# EAGLE schematic BigBus (EAGLE 7.7.0)
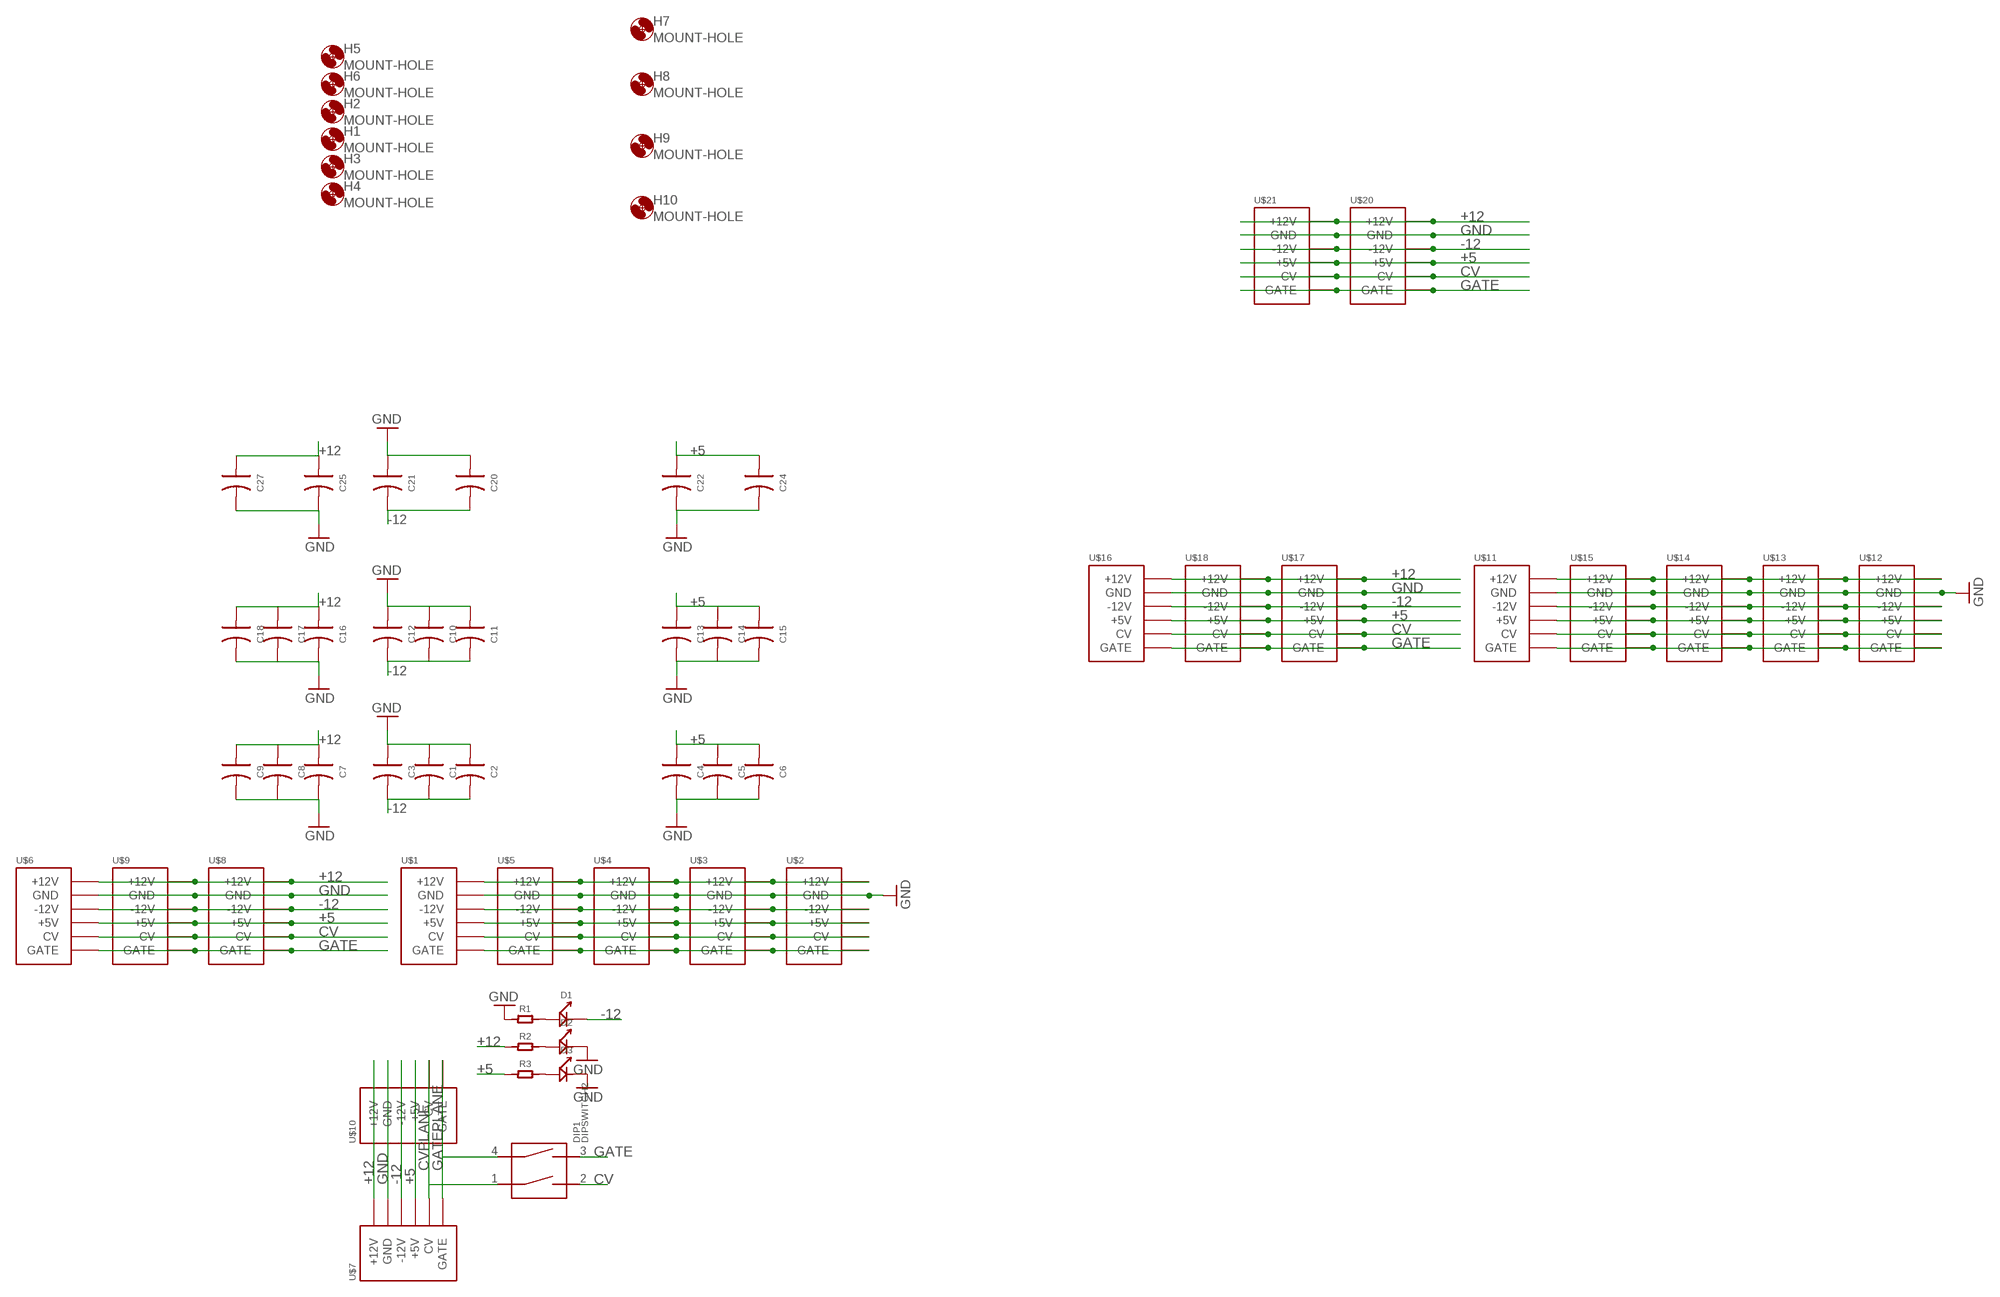
[diagram p0: schematic, sheet 1]

## Parts
C1  C-POLAR-A  [AVX-A]
C2  C-POLAR-A  [AVX-A]
C3  C-POLAR-A  [AVX-A]
C4  C-POLAR-A  [AVX-A]
C5  C-POLAR-A  [AVX-A]
C6  C-POLAR-A  [AVX-A]
C7  C-POLAR-A  [AVX-A]
C8  C-POLAR-A  [AVX-A]
C9  C-POLAR-A  [AVX-A]
C10  C-POLAR-A  [AVX-A]
C11  C-POLAR-A  [AVX-A]
C12  C-POLAR-A  [AVX-A]
C13  C-POLAR-A  [AVX-A]
C14  C-POLAR-A  [AVX-A]
C15  C-POLAR-A  [AVX-A]
C16  C-POLAR-A  [AVX-A]
C17  C-POLAR-A  [AVX-A]
C18  C-POLAR-A  [AVX-A]
C20  C-POLAR-A  [AVX-A]
C21  C-POLAR-A  [AVX-A]
C22  C-POLAR-A  [AVX-A]
C24  C-POLAR-A  [AVX-A]
C25  C-POLAR-A  [AVX-A]
C27  C-POLAR-A  [AVX-A]
D1  LED  [LED0603]
D2  LED  [LED0603]
D3  LED  [LED0603]
DIP1  DIPSWITCH2  [DIPSWITCH2]
H1  MOUNT-HOLE  [3.2-NOMARKINGS-SMALLSAFEZONE]
H2  MOUNT-HOLE  [3.2-NOMARKINGS-SMALLSAFEZONE]
H3  MOUNT-HOLE  [3.2-NOMARKINGS-SMALLSAFEZONE]
H4  MOUNT-HOLE  [3.2-NOMARKINGS-SMALLSAFEZONE]
H5  MOUNT-HOLE  [3.2-NOMARKINGS-SMALLSAFEZONE]
H6  MOUNT-HOLE  [3.2-NOMARKINGS-SMALLSAFEZONE]
H7  MOUNT-HOLE  [3.2-NOMARKINGS-SMALLSAFEZONE]
H8  MOUNT-HOLE  [3.2-NOMARKINGS-SMALLSAFEZONE]
H9  MOUNT-HOLE  [3.2-NOMARKINGS-SMALLSAFEZONE]
H10  MOUNT-HOLE  [3.2-NOMARKINGS-SMALLSAFEZONE]
R1  R-0603  [R0603]
R2  R-0603  [R0603]
R3  R-0603  [R0603]
U$1  POWER  [POWER_16]
U$2  POWER  [POWER_16]
U$3  POWER  [POWER_16]
U$4  POWER  [POWER_16]
U$5  POWER  [POWER_16]
U$6  POWER  [POWER_16]
U$7  POWER  [POWER_16]
U$8  POWER  [POWER_16]
U$9  POWER  [POWER_16]
U$10  POWER  [POWER_16]
U$11  POWER  [POWER_16]
U$12  POWER  [POWER_16]
U$13  POWER  [POWER_16]
U$14  POWER  [POWER_16]
U$15  POWER  [POWER_16]
U$16  POWER  [POWER_16]
U$17  POWER  [POWER_16]
U$18  POWER  [POWER_16]
U$20  POWER  [POWER_16]
U$21  POWER  [POWER_16]

## Nets
+5: C4.+ C5.+ C6.+ C13.+ C14.+ C15.+ C22.+ C24.+ R3.1 U$1.11(+5V) U$1.12(+5V) U$2.11(+5V) U$2.12(+5V) U$3.11(+5V) U$3.12(+5V) U$4.11(+5V) U$4.12(+5V) U$5.11(+5V) U$5.12(+5V) U$6.11(+5V) U$6.12(+5V) U$7.11(+5V) U$7.12(+5V) U$8.11(+5V) U$8.12(+5V) U$9.11(+5V) U$9.12(+5V) U$10.11(+5V) U$10.12(+5V) U$11.11(+5V) U$11.12(+5V) U$12.11(+5V) U$12.12(+5V) U$13.11(+5V) U$13.12(+5V) U$14.11(+5V) U$14.12(+5V) U$15.11(+5V) U$15.12(+5V) U$16.11(+5V) U$16.12(+5V) U$17.11(+5V) U$17.12(+5V) U$18.11(+5V) U$18.12(+5V) U$20.11(+5V) U$20.12(+5V) U$21.11(+5V) U$21.12(+5V)
+12: C7.+ C8.+ C9.+ C16.+ C17.+ C18.+ C25.+ C27.+ R2.1 U$1.9(+12V) U$1.10(+12V) U$2.9(+12V) U$2.10(+12V) U$3.9(+12V) U$3.10(+12V) U$4.9(+12V) U$4.10(+12V) U$5.9(+12V) U$5.10(+12V) U$6.9(+12V) U$6.10(+12V) U$7.9(+12V) U$7.10(+12V) U$8.9(+12V) U$8.10(+12V) U$9.9(+12V) U$9.10(+12V) U$10.9(+12V) U$10.10(+12V) U$11.9(+12V) U$11.10(+12V) U$12.9(+12V) U$12.10(+12V) U$13.9(+12V) U$13.10(+12V) U$14.9(+12V) U$14.10(+12V) U$15.9(+12V) U$15.10(+12V) U$16.9(+12V) U$16.10(+12V) U$17.9(+12V) U$17.10(+12V) U$18.9(+12V) U$18.10(+12V) U$20.9(+12V) U$20.10(+12V) U$21.9(+12V) U$21.10(+12V)
-12: C1.- C2.- C3.- C10.- C11.- C12.- C20.- C21.- D1.- U$1.1(-12V) U$1.2(-12V) U$2.1(-12V) U$2.2(-12V) U$3.1(-12V) U$3.2(-12V) U$4.1(-12V) U$4.2(-12V) U$5.1(-12V) U$5.2(-12V) U$6.1(-12V) U$6.2(-12V) U$7.1(-12V) U$7.2(-12V) U$8.1(-12V) U$8.2(-12V) U$9.1(-12V) U$9.2(-12V) U$10.1(-12V) U$10.2(-12V) U$11.1(-12V) U$11.2(-12V) U$12.1(-12V) U$12.2(-12V) U$13.1(-12V) U$13.2(-12V) U$14.1(-12V) U$14.2(-12V) U$15.1(-12V) U$15.2(-12V) U$16.1(-12V) U$16.2(-12V) U$17.1(-12V) U$17.2(-12V) U$18.1(-12V) U$18.2(-12V) U$20.1(-12V) U$20.2(-12V) U$21.1(-12V) U$21.2(-12V)
CV: DIP1.2 U$1.13(CV) U$1.14(CV) U$2.13(CV) U$2.14(CV) U$3.13(CV) U$3.14(CV) U$4.13(CV) U$4.14(CV) U$5.13(CV) U$5.14(CV) U$6.13(CV) U$6.14(CV) U$8.13(CV) U$8.14(CV) U$9.13(CV) U$9.14(CV) U$11.13(CV) U$11.14(CV) U$12.13(CV) U$12.14(CV) U$13.13(CV) U$13.14(CV) U$14.13(CV) U$14.14(CV) U$15.13(CV) U$15.14(CV) U$16.13(CV) U$16.14(CV) U$17.13(CV) U$17.14(CV) U$18.13(CV) U$18.14(CV) U$20.13(CV) U$20.14(CV) U$21.13(CV) U$21.14(CV)
CVPLANE: DIP1.1 U$7.13(CV) U$7.14(CV) U$10.13(CV) U$10.14(CV)
GATE: DIP1.3 U$1.15(GATE) U$1.16(GATE) U$2.15(GATE) U$2.16(GATE) U$3.15(GATE) U$3.16(GATE) U$4.15(GATE) U$4.16(GATE) U$5.15(GATE) U$5.16(GATE) U$6.15(GATE) U$6.16(GATE) U$8.15(GATE) U$8.16(GATE) U$9.15(GATE) U$9.16(GATE) U$11.15(GATE) U$11.16(GATE) U$12.15(GATE) U$12.16(GATE) U$13.15(GATE) U$13.16(GATE) U$14.15(GATE) U$14.16(GATE) U$15.15(GATE) U$15.16(GATE) U$16.15(GATE) U$16.16(GATE) U$17.15(GATE) U$17.16(GATE) U$18.15(GATE) U$18.16(GATE) U$20.15(GATE) U$20.16(GATE) U$21.15(GATE) U$21.16(GATE)
GATEPLANE: DIP1.4 U$7.15(GATE) U$7.16(GATE) U$10.15(GATE) U$10.16(GATE)
GND: C1.+ C2.+ C3.+ C4.- C5.- C6.- C7.- C8.- C9.- C10.+ C11.+ C12.+ C13.- C14.- C15.- C16.- C17.- C18.- C20.+ C21.+ C22.- C24.- C25.- C27.- D2.- D3.- R1.1 U$1.3(GND) U$1.4(GND) U$1.5(GND) U$1.6(GND) U$1.7(GND) U$1.8(GND) U$2.3(GND) U$2.4(GND) U$2.5(GND) U$2.6(GND) U$2.7(GND) U$2.8(GND) U$3.3(GND) U$3.4(GND) U$3.5(GND) U$3.6(GND) U$3.7(GND) U$3.8(GND) U$4.3(GND) U$4.4(GND) U$4.5(GND) U$4.6(GND) U$4.7(GND) U$4.8(GND) U$5.3(GND) U$5.4(GND) U$5.5(GND) U$5.6(GND) U$5.7(GND) U$5.8(GND) U$6.3(GND) U$6.4(GND) U$6.5(GND) U$6.6(GND) U$6.7(GND) U$6.8(GND) U$7.3(GND) U$7.4(GND) U$7.5(GND) U$7.6(GND) U$7.7(GND) U$7.8(GND) U$8.3(GND) U$8.4(GND) U$8.5(GND) U$8.6(GND) U$8.7(GND) U$8.8(GND) U$9.3(GND) U$9.4(GND) U$9.5(GND) U$9.6(GND) U$9.7(GND) U$9.8(GND) U$10.3(GND) U$10.4(GND) U$10.5(GND) U$10.6(GND) U$10.7(GND) U$10.8(GND) U$11.3(GND) U$11.4(GND) U$11.5(GND) U$11.6(GND) U$11.7(GND) U$11.8(GND) U$12.3(GND) U$12.4(GND) U$12.5(GND) U$12.6(GND) U$12.7(GND) U$12.8(GND) U$13.3(GND) U$13.4(GND) U$13.5(GND) U$13.6(GND) U$13.7(GND) U$13.8(GND) U$14.3(GND) U$14.4(GND) U$14.5(GND) U$14.6(GND) U$14.7(GND) U$14.8(GND) U$15.3(GND) U$15.4(GND) U$15.5(GND) U$15.6(GND) U$15.7(GND) U$15.8(GND) U$16.3(GND) U$16.4(GND) U$16.5(GND) U$16.6(GND) U$16.7(GND) U$16.8(GND) U$17.3(GND) U$17.4(GND) U$17.5(GND) U$17.6(GND) U$17.7(GND) U$17.8(GND) U$18.3(GND) U$18.4(GND) U$18.5(GND) U$18.6(GND) U$18.7(GND) U$18.8(GND) U$20.3(GND) U$20.4(GND) U$20.5(GND) U$20.6(GND) U$20.7(GND) U$20.8(GND) U$21.3(GND) U$21.4(GND) U$21.5(GND) U$21.6(GND) U$21.7(GND) U$21.8(GND)
N$1: D1.+ R1.2
N$2: D2.+ R2.2
N$3: D3.+ R3.2

## Library data of the parts
C1-C18 C20-C22 C24 C25 C27 = OPL:C-POLAR*
D1-D3 = OPL:LED*: LED
DIP1 = carrilib with jtags:DIPSWITCH2: 2 Pole Dip Switch, SMD Manufacturer: CTS Part Number: 219-2LPST
H1-H10 = zephod-components:MOUNT-HOLE: MOUNTING HOLE with drill center marker
R1-R3 = OPL:R*
U$1-U$18 U$20 U$21 = EurorackModularParts:POWER

## Net classes
0 default: width 0.508 mm